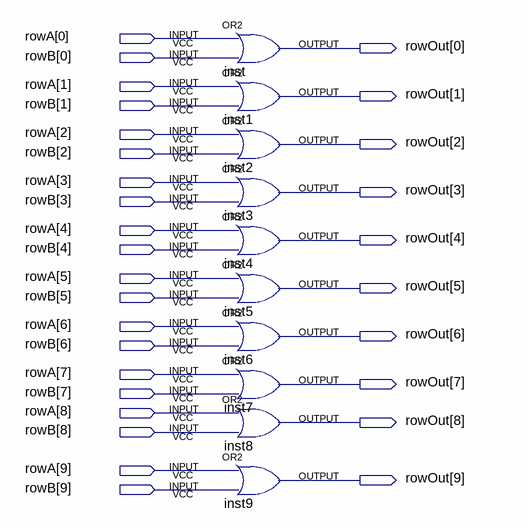
[diagram p0: schematic sheet]
// Quartus schematic rowMerger.bdf as structural Verilog: 10 symbols, 30 pins
module rowMerger (
  input  [9:0] rowA,
  input  [9:0] rowB,
  output [9:0] rowOut
);

  or inst (rowOut[0], rowA[0], rowB[0]);
  or inst1 (rowOut[1], rowA[1], rowB[1]);
  or inst2 (rowOut[2], rowA[2], rowB[2]);
  or inst3 (rowOut[3], rowA[3], rowB[3]);
  or inst4 (rowOut[4], rowA[4], rowB[4]);
  or inst5 (rowOut[5], rowA[5], rowB[5]);
  or inst6 (rowOut[6], rowA[6], rowB[6]);
  or inst7 (rowOut[7], rowA[7], rowB[7]);
  or inst8 (rowOut[8], rowA[8], rowB[8]);
  or inst9 (rowOut[9], rowA[9], rowB[9]);
endmodule
